# Altium schematic sheet ESP8266.SchDoc: ESP8266
size 431 x 279 mm; DrawnBy: Ethan Abraham; Engineer: Ethan Abraham; Revision: 1.0; SheetNumber: 5; SheetTotal: 7
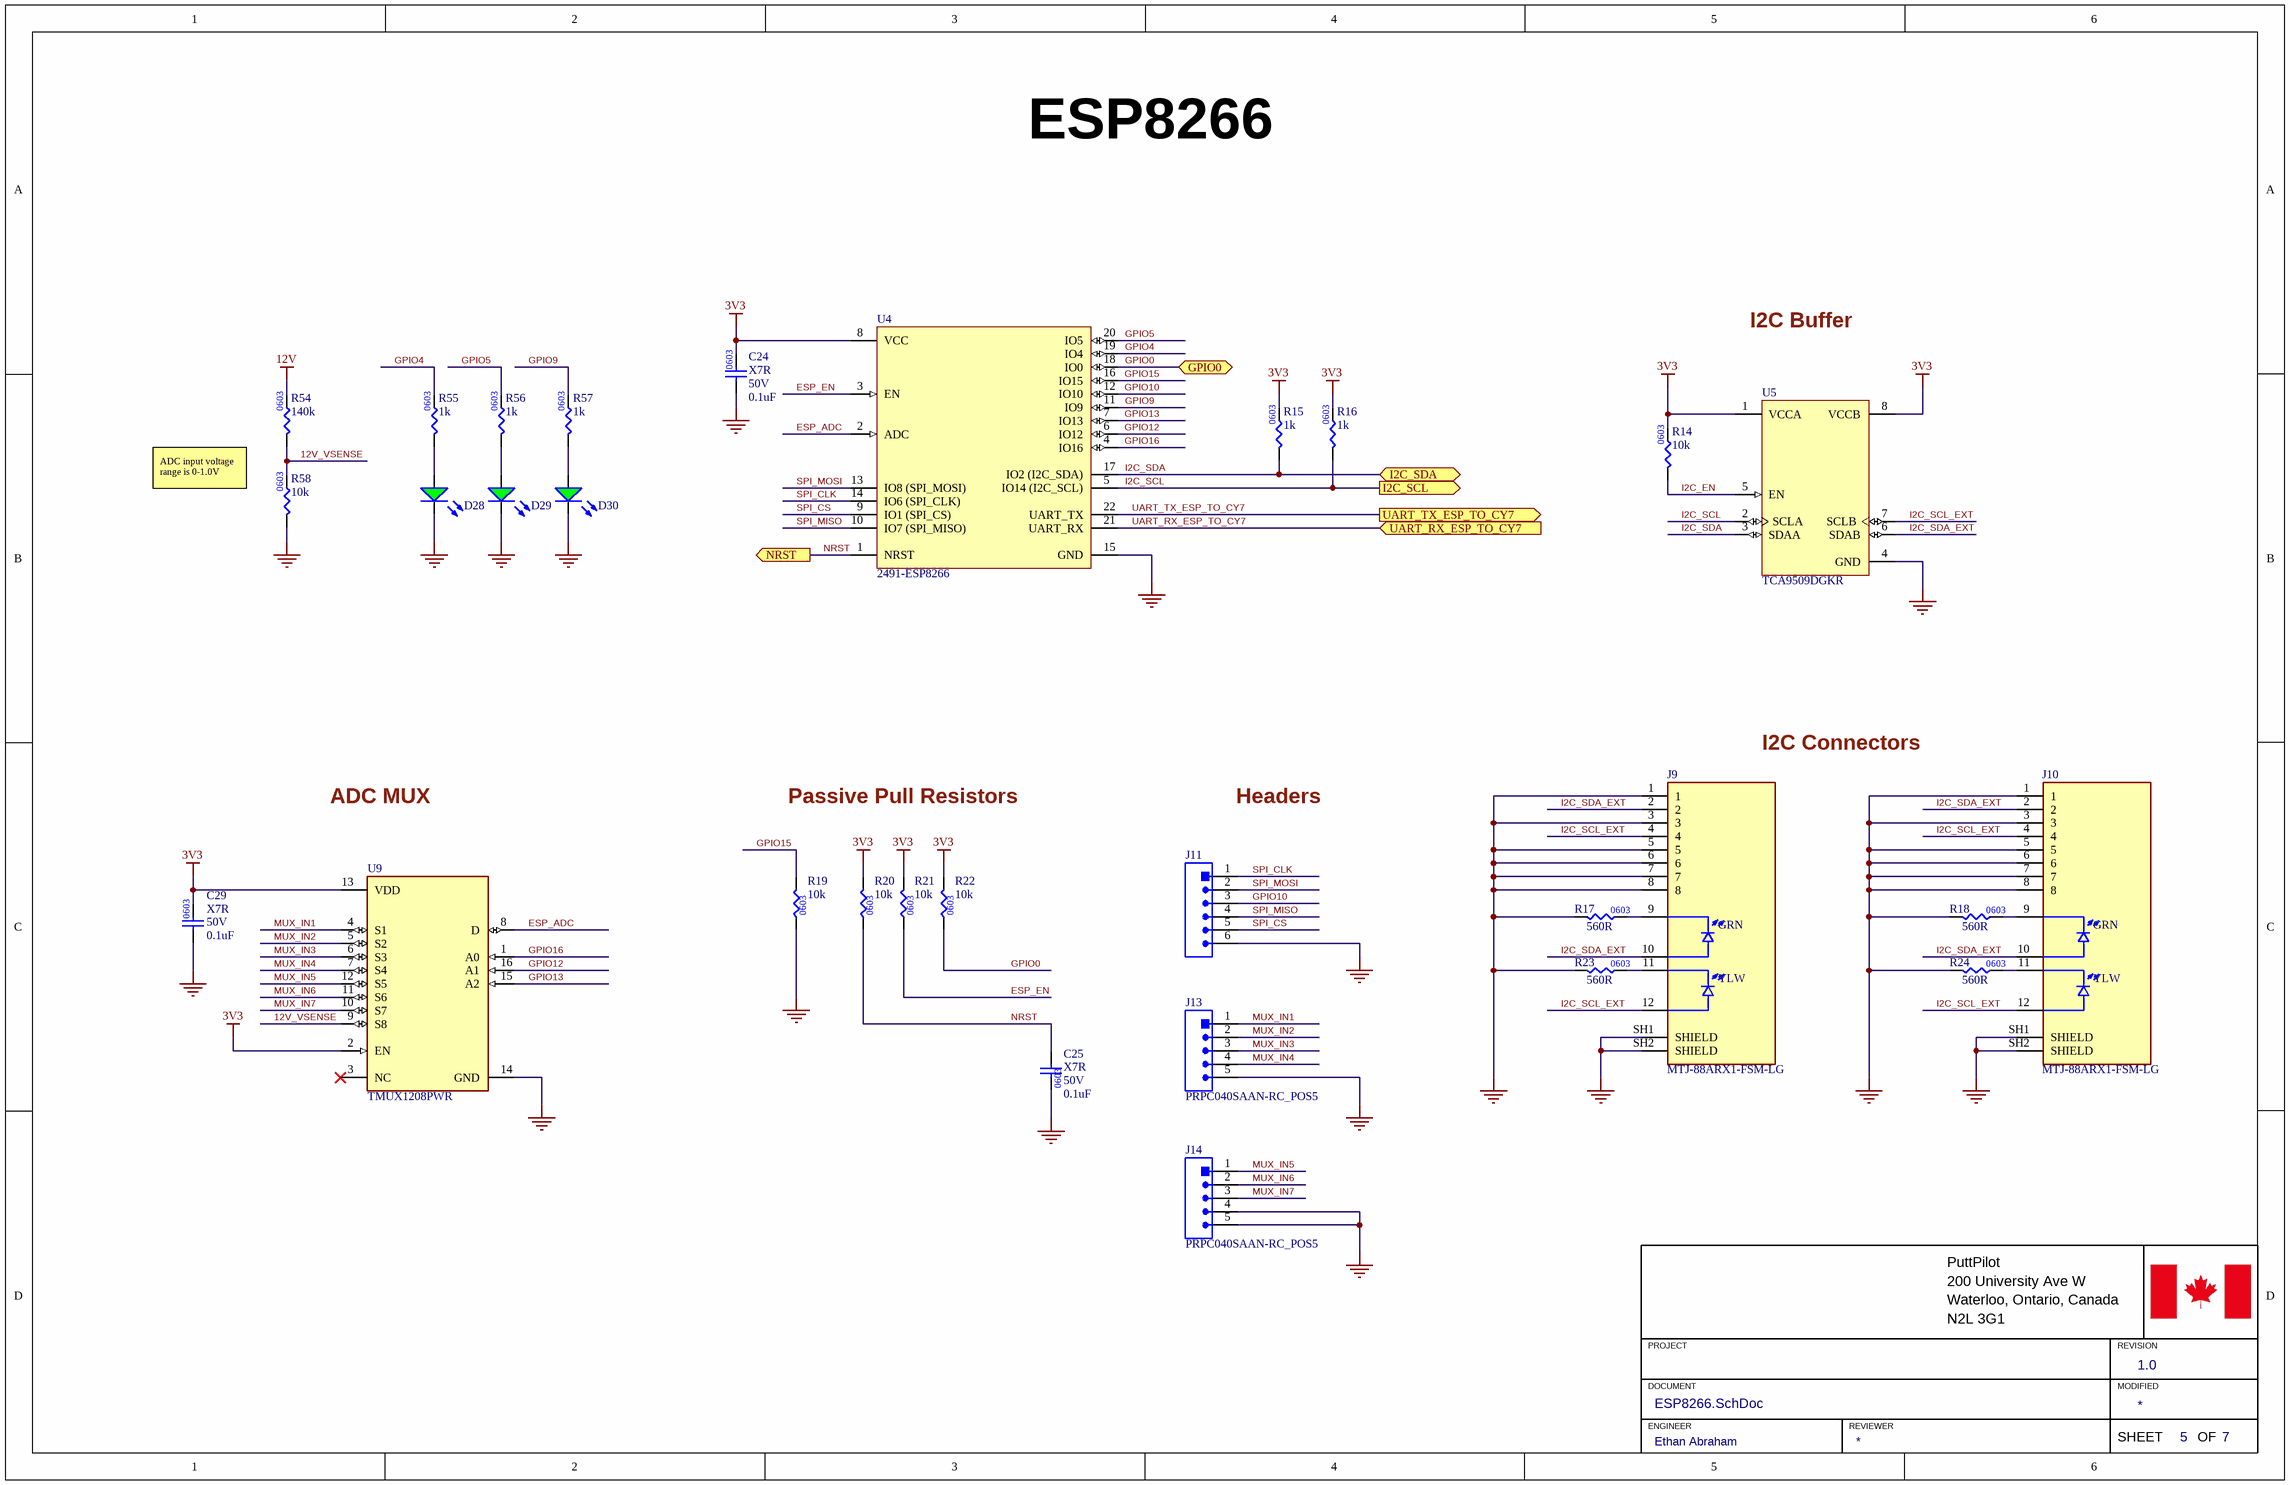
[diagram p0: ESP8266.SchDoc]

## Parts
C24  Temperature Characteristics Code: X7R  Rated DC Voltage (URdc): 50V  Capacitance: 0.1uF  [.CAP_0603]  (hidden comment: GCJ188R71H104KA12D)
C25  Temperature Characteristics Code: X7R  Rated DC Voltage (URdc): 50V  Capacitance: 0.1uF  [.CAP_0603]  (hidden comment: GCJ188R71H104KA12D)
C29  Temperature Characteristics Code: X7R  Rated DC Voltage (URdc): 50V  Capacitance: 0.1uF  [.CAP_0603]  (hidden comment: GCJ188R71H104KA12D)
D28  LTST-C191KGKT  [.LED_0603]  (value not drawn)
D29  LTST-C191KGKT  [.LED_0603]  (value not drawn)
D30  LTST-C191KGKT  [.LED_0603]  (value not drawn)
J9  MTJ-88ARX1-FSM-LG  [MTJ-88ARX1-FSM-LG]
J10  MTJ-88ARX1-FSM-LG  [MTJ-88ARX1-FSM-LG]
J11  PRPC040SAAN-RC_POS6  [HEADER_6POS_2.54MM]  (value not drawn)
J13  PRPC040SAAN-RC_POS5  [HEADER_5POS_2.54MM]
J14  PRPC040SAAN-RC_POS5  [HEADER_5POS_2.54MM]
R14  Resistance: 10k  [.RES_0603]  (hidden comment: RC0603FR-0710KL)
R15  Resistance: 1k  [.RES_0603]  (hidden comment: RC0603FR-071KL)
R16  Resistance: 1k  [.RES_0603]  (hidden comment: RC0603FR-071KL)
R17  Resistance: 560R  [.RES_0603]  (hidden comment: RC0603FR-07560RL)
R18  Resistance: 560R  [.RES_0603]  (hidden comment: RC0603FR-07560RL)
R19  Resistance: 10k  [.RES_0603]  (hidden comment: RC0603FR-0710KL)
R20  Resistance: 10k  [.RES_0603]  (hidden comment: RC0603FR-0710KL)
R21  Resistance: 10k  [.RES_0603]  (hidden comment: RC0603FR-0710KL)
R22  Resistance: 10k  [.RES_0603]  (hidden comment: RC0603FR-0710KL)
R23  Resistance: 560R  [.RES_0603]  (hidden comment: RC0603FR-07560RL)
R24  Resistance: 560R  [.RES_0603]  (hidden comment: RC0603FR-07560RL)
R54  Resistance: 140k  [.RES_0603]  (hidden comment: RC0603FR-07140KL)
R55  Resistance: 1k  [.RES_0603]  (hidden comment: RC0603FR-071KL)
R56  Resistance: 1k  [.RES_0603]  (hidden comment: RC0603FR-071KL)
R57  Resistance: 1k  [.RES_0603]  (hidden comment: RC0603FR-071KL)
R58  Resistance: 10k  [.RES_0603]  (hidden comment: RC0603FR-0710KL)
U4  2491-ESP8266  [2491-ESP8266]
U5  TCA9509DGKR  [TCA9509DGKR]
U9  TMUX1208PWR  [TMUX1208]

## Ports
GPIO0 (bidir), I2C_SCL (out), I2C_SDA (bidir), NRST (out), UART_RX_ESP_TO_CY7 (in), UART_TX_ESP_TO_CY7 (out)

## Nets
3V3: C24.2 C29.2 R14.2 R15.2 R16.2 R20.2 R21.2 R22.2 U4.8(VCC) U5.1(VCCA) U5.8(VCCB) U9.2(EN) U9.13(VDD)
12V: R54.2
GND: C24.1 C25.1 C29.1 D28.2(K) D29.2(K) D30.2(K) J9.1 J9.3 J9.5 J9.6 J9.7 J9.8 J9.SH1(SHIELD) J9.SH2(SHIELD) J10.1 J10.3 J10.5 J10.6 J10.7 J10.8 J10.SH1(SHIELD) J10.SH2(SHIELD) J11.6 J13.5 J14.4 J14.5 R17.1 R18.1 R19.1 R23.1 R24.1 R58.1 U4.15(GND) U5.4(GND) U9.14(GND)
12V_VSENSE: R54.1 R58.2 U9.9(S8)
ESP_ADC: U4.2(ADC) U9.8(D)
ESP_EN: R21.1 U4.3(EN)
GPIO0: R22.1 U4.18(IO0) ; port GPIO0
GPIO4: R55.2 U4.19(IO4)
GPIO5: R56.2 U4.20(IO5)
GPIO9: R57.2 U4.11(IO9)
GPIO10: J11.3 U4.12(IO10)
GPIO12: U4.6(IO12) U9.16(A1)
GPIO13: U4.7(IO13) U9.15(A2)
GPIO15: R19.2 U4.16(IO15)
GPIO16: U4.4(IO16) U9.1(A0)
I2C_EN: R14.1 U5.5(EN)
I2C_SCL: R16.1 U4.5(IO14_(I2C_SCL)) U5.2(SCLA) ; port I2C_SCL
I2C_SCL_EXT: J9.4 J9.12 J10.4 J10.12 U5.7(SCLB)
I2C_SDA: R15.1 U4.17(IO2_(I2C_SDA)) U5.3(SDAA) ; port I2C_SDA
I2C_SDA_EXT: J9.2 J9.10 J10.2 J10.10 U5.6(SDAB)
MUX_IN1: J13.1 U9.4(S1)
MUX_IN2: J13.2 U9.5(S2)
MUX_IN3: J13.3 U9.6(S3)
MUX_IN4: J13.4 U9.7(S4)
MUX_IN5: J14.1 U9.12(S5)
MUX_IN6: J14.2 U9.11(S6)
MUX_IN7: J14.3 U9.10(S7)
NRST: C25.2 R20.1 U4.1(NRST) ; port NRST
SPI_CLK: J11.1 U4.14(IO6_(SPI_CLK))
SPI_CS: J11.5 U4.9(IO1_(SPI_CS))
SPI_MISO: J11.4 U4.10(IO7_(SPI_MISO))
SPI_MOSI: J11.2 U4.13(IO8_(SPI_MOSI))
UART_RX_ESP_TO_CY7: U4.21(UART_RX) ; port UART_RX_ESP_TO_CY7
UART_TX_ESP_TO_CY7: U4.22(UART_TX) ; port UART_TX_ESP_TO_CY7
NetD28_1: D28.1(A) R55.1
NetD29_1: D29.1(A) R56.1
NetD30_1: D30.1(A) R57.1
NetJ9_9: J9.9 R17.2
NetJ9_11: J9.11 R23.2
NetJ10_9: J10.9 R18.2
NetJ10_11: J10.11 R24.2

Not connected (* = marked no-connect by the designer): U9 3(NC)*

## Notes on the sheet
- I2C Buffer
- ADC input voltage range is 0-1.0V
- I2C Connectors
- ADC MUX
- Passive Pull Resistors
- Headers
- PuttPilot
- 200 University Ave W
- Waterloo, Ontario, Canada
- PROJECT
- N2L 3G1
- REVISION
- DOCUMENT
- ENGINEER
- REVIEWER
- MODIFIED
- SHEET
- OF
- (in symbol MTJ-88ARX1-FSM-LG) GRN; YLW

## Library data of the parts
C24 C25 C29 = GCJ188R71H104KA12D: CAP CER 0.1uF 50V X7R 0603; Manufacturer: Murata; Dielectric Material: Ceramic; Multilayer: Yes; Negative Tolerance: 10%; Reference Standard: AEC-Q200; Supplier 1: Future Electronics; Manufacturer Part Number: GCJ188R71H104KA12D; RoHS: Yes; Category: Ceramic Capacitors; Stock 1: 3280000; Pricing 1: 4000=0.0182, 12000=0.0178, 20000=0.0176, 80000=0.017, 120000=0.0167 (USD); Mount: Surface Mount; Number of Pins: 2; Package Shape: Rectangular; Size Code: 0603; Terminal Finish: Nickel; Min Operating Temperature: -55°C; Max Operating Temperature: 125°C; JESD-609 Code: e3; Capacitor Type: Ceramic; Package Style: SMTMeter; Packaging: Tape and Reel; Positive Tolerance: 10%; Termination: Wraparound; Length: 1.6mm; Width: 0.8mm; Height: 0.8mm; Reach SVHC Compliant: Yes; RoHS Compliant: Yes; ComponentLink1URL: https://psearch.en.murata.com:443/capacitor/product/GCJ188R71H104KA12%23.pdf?src-supplier=IHS+Markit; ComponentLink1Description: https://psearch.en.murata.com:443/capacitor/product/GCJ188R71H104KA12%23.pdf?src-supplier=IHS+Markit; ComponentLink2URL: https://datasheet.ciiva.com/135/product-135604.pdf?src-supplier=Digikey; ComponentLink2Description: https://datasheet.ciiva.com/135/product-135604.pdf?src-supplier=Digikey; ComponentLink3URL: https://datasheet.ciiva.com/26889/getdatasheetpartid-369886-26889118.pdf?src-supplier=Verical; ComponentLink3Description: https://datasheet.ciiva.com/26889/getdatasheetpartid-369886-26889118.pdf?src-supplier=Verical; ComponentLink4URL: https://datasheet.ciiva.com/135/s0717e-135605.pdf?src-supplier=Digikey; ComponentLink4Description: https://datasheet.ciiva.com/135/s0717e-135605.pdf?src-supplier=Digikey; ComponentLink5URL: https://datasheet.ciiva.com/135/s0717e-135606.pdf?src-supplier=Digikey; ComponentLink5Description: https://datasheet.ciiva.com/135/s0717e-135606.pdf?src-supplier=Digikey; ComponentLink6URL: https://datasheet.ciiva.com/16440/c03e-16440425.pdf?src-supplier=Future+Electronics; ComponentLink6Description: https://datasheet.ciiva.com/16440/c03e-16440425.pdf?src-supplier=Future+Electronics; Supplier Part Number 1: 1158604
D28-D30 = LTST-C191KGKT: LED GREEN 2V 0603; Manufacturer: Vishay Lite-On; Shape: Rectangular; Lens Style: WATER CLEAR; Forward Current-Max: 30mA; Luminous Intensity-Nom: 35mcd; Number of Functions: 1; Optoelectronic Device Type: SINGLE COLOR LED; Viewing Angle: 130°; Forward Voltage-Max: 2.4V; Reverse Voltage-Max: 5V; Overall Height: 0.55mm; Supplier 1: Digikey; Manufacturer Part Number: LTST-C191KGKT; RoHS: Yes; Stock 1: 171853; Pricing 1: 1=0.22, 10=0.121, 100=0.0721, 500=0.05324, 1000=0.04748, 2000=0.04278 (USD); Mount: Surface Mount; Number of Pins: 2; Color: Green; Color@wavelength: Green; Terminal Finish: Tin; Min Operating Temperature: -55°C; Max Operating Temperature: 85°C; Packaging: Tape and Reel; JESD-609 Code: e3; Size: 1.1mm; Terminal Pitch: 1.5mm; Reach SVHC Compliant: Yes; RoHS Compliant: Yes; ComponentLink1URL: https://datasheet.ciiva.com:443/pdfs/VipMasterIC/IC/LITE/LITE-S-A0003156116/LITE-S-A0003156116-1.pdf?src-supplier=IHS+Markit; ComponentLink1Description: https://datasheet.ciiva.com:443/pdfs/VipMasterIC/IC/LITE/LITE-S-A0003156116/LITE-S-A0003156116-1.pdf?src-supplier=IHS+Markit; ComponentLink2URL: https://datasheet.ciiva.com/2109/ltst-c191kgkt-2109973.pdf?src-supplier=Digikey; ComponentLink2Description: https://datasheet.ciiva.com/2109/ltst-c191kgkt-2109973.pdf?src-supplier=Digikey; Supplier Part Number 1: 160-1446-1-ND
J9 J10 = MTJ-88ARX1-FSM-LG: RJ45 JACK R/A SHIELDED; Manufacturer: Adam Equipment; Supplier 1: Digikey; Manufacturer Part Number: MTJ-88ARX1-FSM-LG; RoHS: No; Category: Connectors; Stock 1: 4560; Pricing 1: 1=0.99, 10=0.756, 25=0.68, 60=0.61483, 120=0.56858, 240=0.52642, 480=0.48815, 960=0.4534, 2400=0.41238 (USD); ComponentLink1URL: http://www.adam-tech.com/downloader.php?p=MTJ-88ARX1-FSM-LX.pdf&src-supplier=Digikey; ComponentLink1Description: http://www.adam-tech.com/downloader.php?p=MTJ-88ARX1-FSM-LX.pdf&src-supplier=Digikey; Supplier Part Number 1: 2057-MTJ-88ARX1-FSM-LG-ND
J11 = PRPC040SAAN-RC_POS6: CONN HEADER VERT 6POS 2.54MM
J13 J14 = PRPC040SAAN-RC_POS5: CONN HEADER VERT 5POS 2.54MM
R14 R19-R22 R58 = RC0603FR-0710KL: RES 10K OHM 0603; Manufacturer: Yageo; Tolerance: 1%; Additional Feature: LASER TRIMMABLE; Rated Power Dissipation (P): 100mW; Rated Temperature: 70°C; Temperature Coefficient: 100ppm/°C; Working Voltage: 75V; Package Height: 0.45mm; Package Length: 1.6mm; Package Width: 0.8mm; Supplier 1: Future Electronics; Manufacturer Part Number: RC0603FR-0710KL; RoHS: Yes; Category: Chip SMD Resistors; Stock 1: 30355000; Pricing 1: 5000=0.0026, 50000=0.0025, 150000=0.0024, 375000=0.0023, 1000000=0.0022 (USD); Mount: Surface Mount; Number of Pins: 2; Package Shape: Rectangular; Size Code: 0603; Terminal Finish: Nickel; Min Operating Temperature: -55°C; Max Operating Temperature: 155°C; JESD-609 Code: e3; Resistor Type: FIXED RESISTOR; Construction: Chip; Package Style: SMTMeter; Packaging: Tape and Reel; Technology: METAL GLAZE/THICK FILM; Termination: Wraparound; Reach SVHC Compliant: Yes; RoHS Compliant: Yes; ComponentLink1URL: https://datasheet.ciiva.com:443/pdfs/VipMasterIC/IC/YAGO/YAGO-S-A0008145938/YAGO-S-A0008145938-1.pdf?src-supplier=IHS+Markit; ComponentLink1Description: https://datasheet.ciiva.com:443/pdfs/VipMasterIC/IC/YAGO/YAGO-S-A0008145938/YAGO-S-A0008145938-1.pdf?src-supplier=IHS+Markit; ComponentLink2URL: https://datasheet.ciiva.com/22747/443971-22747519.pdf?src-supplier=Element14; ComponentLink2Description: https://datasheet.ciiva.com/22747/443971-22747519.pdf?src-supplier=Element14; ComponentLink3URL: https://datasheet.ciiva.com/46440/1868787-46440891.pdf?src-supplier=Element14; ComponentLink3Description: https://datasheet.ciiva.com/46440/1868787-46440891.pdf?src-supplier=Element14; ComponentLink4URL: https://datasheet.ciiva.com/15189/getdatasheetpartid-409289-15189591.pdf?src-supplier=Verical; ComponentLink4Description: https://datasheet.ciiva.com/15189/getdatasheetpartid-409289-15189591.pdf?src-supplier=Verical; ComponentLink5URL: https://datasheet.ciiva.com/7660/38590-7660789.pdf?src-supplier=Element14; ComponentLink5Description: https://datasheet.ciiva.com/7660/38590-7660789.pdf?src-supplier=Element14; ComponentLink6URL: https://datasheet.ciiva.com/7746/1738695-7746239.pdf?src-supplier=Element14; ComponentLink6Description: https://datasheet.ciiva.com/7746/1738695-7746239.pdf?src-supplier=Element14; ComponentLink7URL: https://datasheet.ciiva.com/7983/443971-7983596.pdf?src-supplier=Element14; ComponentLink7Description: https://datasheet.ciiva.com/7983/443971-7983596.pdf?src-supplier=Element14; Supplier Part Number 1: 4023214
R15 R16 R55-R57 = RC0603FR-071KL: RES 1K OHM 0603; Manufacturer: Yageo; Tolerance: 1%; Additional Feature: LASER TRIMMABLE; Rated Power Dissipation (P): 100mW; Rated Temperature: 70°C; Temperature Coefficient: 100ppm/°C; Working Voltage: 75V; Package Height: 0.45mm; Package Length: 1.6mm; Package Width: 0.8mm; Supplier 1: Future Electronics; Manufacturer Part Number: RC0603FR-071KL; RoHS: Yes; Category: Chip SMD Resistors; Stock 1: 12810000; Pricing 1: 5000=0.0026, 50000=0.0025, 150000=0.0024, 375000=0.0023, 1000000=0.0022 (USD); Mount: Surface Mount; Number of Pins: 2; Package Shape: Rectangular; Size Code: 0603; Terminal Finish: Nickel; Min Operating Temperature: -55°C; Max Operating Temperature: 155°C; JESD-609 Code: e3; Resistor Type: FIXED RESISTOR; Construction: Chip; Package Style: SMTMeter; Packaging: Tape and Reel; Technology: METAL GLAZE/THICK FILM; Termination: Wraparound; Reach SVHC Compliant: Yes; RoHS Compliant: Yes; ComponentLink1URL: https://datasheet.ciiva.com:443/pdfs/VipMasterIC/IC/YAGO/YAGO-S-A0008145938/YAGO-S-A0008145938-1.pdf?src-supplier=IHS+Markit; ComponentLink1Description: https://datasheet.ciiva.com:443/pdfs/VipMasterIC/IC/YAGO/YAGO-S-A0008145938/YAGO-S-A0008145938-1.pdf?src-supplier=IHS+Markit; ComponentLink2URL: https://datasheet.ciiva.com/11808/0900766b80f96399-11808081.pdf?src-supplier=Rs; ComponentLink2Description: https://datasheet.ciiva.com/11808/0900766b80f96399-11808081.pdf?src-supplier=Rs; ComponentLink3URL: https://datasheet.ciiva.com/8896/pyu-rc0603-51-rohs-l-4-8896106.pdf?src-supplier=Avnet; ComponentLink3Description: https://datasheet.ciiva.com/8896/pyu-rc0603-51-rohs-l-4-8896106.pdf?src-supplier=Avnet; ComponentLink4URL: https://datasheet.ciiva.com/7660/1868787-7660790.pdf?src-supplier=Element14; ComponentLink4Description: https://datasheet.ciiva.com/7660/1868787-7660790.pdf?src-supplier=Element14; ComponentLink5URL: https://datasheet.ciiva.com/7746/1738695-7746279.pdf?src-supplier=Element14; ComponentLink5Description: https://datasheet.ciiva.com/7746/1738695-7746279.pdf?src-supplier=Element14; ComponentLink6URL: https://datasheet.ciiva.com/7746/1686128-7746280.pdf?src-supplier=Element14; ComponentLink6Description: https://datasheet.ciiva.com/7746/1686128-7746280.pdf?src-supplier=Element14; ComponentLink7URL: https://datasheet.ciiva.com/7746/1738695-7746281.pdf?src-supplier=Element14; ComponentLink7Description: https://datasheet.ciiva.com/7746/1738695-7746281.pdf?src-supplier=Element14; ComponentLink8URL: https://datasheet.ciiva.com/7983/443971-7983613.pdf?src-supplier=Element14; ComponentLink8Description: https://datasheet.ciiva.com/7983/443971-7983613.pdf?src-supplier=Element14; ComponentLink9URL: https://datasheet.ciiva.com/15189/getdatasheetpartid-404327-15189644.pdf?src-supplier=Verical; ComponentLink9Description: https://datasheet.ciiva.com/15189/getdatasheetpartid-404327-15189644.pdf?src-supplier=Verical; Supplier Part Number 1: 4016291
R17 R18 R23 R24 = RC0603FR-07560RL: RES 560 OHM 0603; Manufacturer: Yageo; Tolerance: 1%; Voltage Rating (DC): 50V; Temperature Coefficient: 100ppm/°C; Power Rating: 100mW; Voltage Rating: 75V; Supplier 1: Future Electronics; Manufacturer Part Number: RC0603FR-07560RL; RoHS: Yes; Category: Chip SMD Resistors; Stock 1: 185000; Pricing 1: 5000=0.002, 50000=0.0019, 150000=0.0019, 375000=0.0018, 1000000=0.0017 (USD); Case/Package: 0603; Number of Pins: 2; Case Code (Imperial): 0603; Case Code (Metric): 1608; Weight: 7.1E-05oz; Min Operating Temperature: -55°C; Max Operating Temperature: 155°C; Packaging: Tape and Reel; Resistor Type: Thick Film; Package Quantity: 1; Termination: SMD/SMT; Number of Terminations: 2; Max Power Dissipation: 100mW; Features: Moisture Resistant; Series: RC; Construction: Rectangular; Resistance Tolerance: 1%; Technology: THICK FILM; Voltage Rating (AC): 50V; Length: 1.6mm; Width: 0.8mm; Height: 0.45mm; Depth: 0.8mm; Reach SVHC Compliant: No; Lead Free: Lead Free; Military Standard: Not; RoHS Compliant: Yes; ComponentLink1URL: https://datasheet.ciiva.com/11808/0900766b80f96399-11808127.pdf?src-supplier=Rs; ComponentLink1Description: https://datasheet.ciiva.com/11808/0900766b80f96399-11808127.pdf?src-supplier=Rs; ComponentLink2URL: https://datasheet.ciiva.com/2454/pyu-r-int-thick-7-2454381.pdf?src-supplier=Digikey; ComponentLink2Description: https://datasheet.ciiva.com/2454/pyu-r-int-thick-7-2454381.pdf?src-supplier=Digikey; ComponentLink3URL: https://datasheet.ciiva.com/2454/pyu-r-int-thick-7-2454382.pdf?src-supplier=Digikey; ComponentLink3Description: https://datasheet.ciiva.com/2454/pyu-r-int-thick-7-2454382.pdf?src-supplier=Digikey; ComponentLink4URL: https://datasheet.ciiva.com/2454/pyu-r-int-thick-7-2454383.pdf?src-supplier=Digikey; ComponentLink4Description: https://datasheet.ciiva.com/2454/pyu-r-int-thick-7-2454383.pdf?src-supplier=Digikey; ComponentLink5URL: https://datasheet.ciiva.com/7746/443971-7746374.pdf?src-supplier=Element14; ComponentLink5Description: https://datasheet.ciiva.com/7746/443971-7746374.pdf?src-supplier=Element14; ComponentLink6URL: https://datasheet.ciiva.com/7746/443971-7746375.pdf?src-supplier=Element14; ComponentLink6Description: https://datasheet.ciiva.com/7746/443971-7746375.pdf?src-supplier=Element14; ComponentLink7URL: https://datasheet.ciiva.com/46412/443971-46412853.pdf?src-supplier=Element14; ComponentLink7Description: https://datasheet.ciiva.com/46412/443971-46412853.pdf?src-supplier=Element14; Supplier Part Number 1: 3410891
R54 = RC0603FR-07140KL: RES 140K OHM 0603; Manufacturer: Yageo; Tolerance: 1%; Power Rating: 100mW; Voltage Rating: 50V; Temperature Coefficient: 100ppm/°C; Supplier 1: Digikey; Manufacturer Part Number: RC0603FR-07140KL; RoHS: Yes; Category: Chip SMD Resistors; Stock 1: 245928; Pricing 1: 1=0.1, 10=0.011, 50=0.0086, 500=0.00612, 1000=0.00408 (USD); Case/Package: 0603; Case Code (Imperial): 0603; Case Code (Metric): 1608; Size Code: 0603; Min Operating Temperature: -55°C; Max Operating Temperature: 155°C; Packaging: Tape and Reel; Termination: SMD/SMT; Number of Terminations: 2; Max Power Dissipation: 100mW; Voltage Rating (DC): 50V; Features: Moisture Resistant; Series: RC; Length: 1.6mm; Width: 0.8mm; Height: 0.45mm; Lead Free: Lead Free; RoHS Compliant: Yes; ComponentLink1URL: https://datasheet.ciiva.com/2453/pyu-r-int-thick-7-2453916.pdf?src-supplier=Digikey; ComponentLink1Description: https://datasheet.ciiva.com/2453/pyu-r-int-thick-7-2453916.pdf?src-supplier=Digikey; ComponentLink2URL: https://datasheet.ciiva.com/2453/pyu-r-int-thick-7-2453917.pdf?src-supplier=Digikey; ComponentLink2Description: https://datasheet.ciiva.com/2453/pyu-r-int-thick-7-2453917.pdf?src-supplier=Digikey; ComponentLink3URL: https://datasheet.ciiva.com/2453/pyu-r-int-thick-7-2453918.pdf?src-supplier=Digikey; ComponentLink3Description: https://datasheet.ciiva.com/2453/pyu-r-int-thick-7-2453918.pdf?src-supplier=Digikey; Supplier Part Number 1: 311-140KHRCT-ND
U4 = 2491-ESP8266: ESP8266 + Trace Antenna, 4MB Flash
U5 = TCA9509DGKR: I2C BUFFER IC; Manufacturer: Texas Instruments; Package Body Material: Plastic; Interface IC Type: INTERFACE CIRCUIT; Number of Functions: 1; Package Equivalence Code: TSSOP8,.19; Power Supplies: 3/5V; Max Supply Voltage: 5.5V; Min Supply Voltage: 2.7V; Qualification Status: Not Qualified; Supplier 1: Digikey; Manufacturer Part Number: TCA9509DGKR; RoHS: Yes; Category: Interface ICs; Stock 1: 54600; Pricing 1: 1=1.27, 10=0.885, 25=0.7892, 100=0.6844, 250=0.63436, 500=0.60416, 1000=0.57931 (USD); Package Code: TSSOP; Number of Pins: 8; Package Shape: Square; Terminal Finish: Gold; Min Operating Temperature: -40°C; Max Operating Temperature: 85°C; JESD-609 Code: e4; JESD-30 Code: S-PDSO-G8; Moisture Sensitivity Level: 1; Package Style: SMALL OUTLINE, THIN PROFILE, SHRINK PITCHMeter; Peak Reflow Temperature (Cel): 260°C; Surface Mount: Yes; Terminal Form: Gull Wing; Terminal Position: DUAL; Length: 3mm; Width: 3mm; Height - Seated (Max): 1.1mm; Terminal Pitch: 0.65mm; Temperature Grade: INDUSTRIAL; Reach SVHC Compliant: Yes; RoHS Compliant: Yes; ComponentLink1URL: https://www.ti.com:443/lit/ds/symlink/tca9509.pdf?src-supplier=IHS+Markit; ComponentLink1Description: https://www.ti.com:443/lit/ds/symlink/tca9509.pdf?src-supplier=IHS+Markit; ComponentLink2URL: https://datasheet.ciiva.com/22791/tca9509-22791264.pdf?src-supplier=Farnell; ComponentLink2Description: https://datasheet.ciiva.com/22791/tca9509-22791264.pdf?src-supplier=Farnell; ComponentLink3URL: https://datasheet.ciiva.com/3149/tca9509-3149522.pdf?src-supplier=Avnet; ComponentLink3Description: https://datasheet.ciiva.com/3149/tca9509-3149522.pdf?src-supplier=Avnet; ComponentLink4URL: https://datasheet.ciiva.com/26911/getdatasheetpartid-476504-26911504.pdf?src-supplier=Verical; ComponentLink4Description: https://datasheet.ciiva.com/26911/getdatasheetpartid-476504-26911504.pdf?src-supplier=Verical; ComponentLink5URL: https://datasheet.ciiva.com/41460/001187989-da-01-en-ic-i2c-bus-rep-l-tca9509dgkr-vssop-8-tid-41460370.pdf?src-supplier=Conrad; ComponentLink5Description: https://datasheet.ciiva.com/41460/001187989-da-01-en-ic-i2c-bus-rep-l-tca9509dgkr-vssop-8-tid-41460370.pdf?src-supplier=Conrad; ComponentLink6URL: https://datasheet.ciiva.com/1784/tca9509-1784225.pdf?src-supplier=Digikey; ComponentLink6Description: https://datasheet.ciiva.com/1784/tca9509-1784225.pdf?src-supplier=Digikey; ComponentLink7URL: https://datasheet.ciiva.com/1784/tca9509-1784226.pdf?src-supplier=Digikey; ComponentLink7Description: https://datasheet.ciiva.com/1784/tca9509-1784226.pdf?src-supplier=Digikey; ComponentLink8URL: https://datasheet.ciiva.com/1784/tca9509-1784227.pdf?src-supplier=Digikey; ComponentLink8Description: https://datasheet.ciiva.com/1784/tca9509-1784227.pdf?src-supplier=Digikey; Supplier Part Number 1: 296-30283-1-ND
U9 = TMUX1208PWR: Single-Ended Multiplexer, 1 Func, 8 Channel, CMOS, PDSO16; Manufacturer: Texas Instruments; Supplier 1: Mouser; Manufacturer Part Number: TMUX1208PWR; RoHS: Yes; Category: Decoders and Multiplexers; Stock 1: 17357; Pricing 1: 1=0.71, 10=0.437, 50=0.437, 100=0.348, 1000=0.311, 10000=0.287 (USD); Analog IC - Other Type: SINGLE-ENDED MULTIPLEXER; Reach SVHC Compliant: Yes; RoHS Compliant: Yes; ComponentLink1URL: https://www.ti.com:443/lit/ds/symlink/tmux1208.pdf?src-supplier=IHS+Markit; ComponentLink1Description: https://www.ti.com:443/lit/ds/symlink/tmux1208.pdf?src-supplier=IHS+Markit; ComponentLink2URL: http://www.ti.com/general/docs/suppproductinfo.tsp?distId=10&amp;gotoUrl=http%3A%2F%2Fwww.ti.com%2Flit%2Fgpn%2Ftmux1208&src-supplier=Digikey; ComponentLink2Description: http://www.ti.com/general/docs/suppproductinfo.tsp?distId=10&amp;gotoUrl=http%3A%2F%2Fwww.ti.com%2Flit%2Fgpn%2Ftmux1208&src-supplier=Digikey; Supplier Part Number 1: 595-TMUX1208PWR